# EAGLE design interstage_A2 (EAGLE 9.6.1)
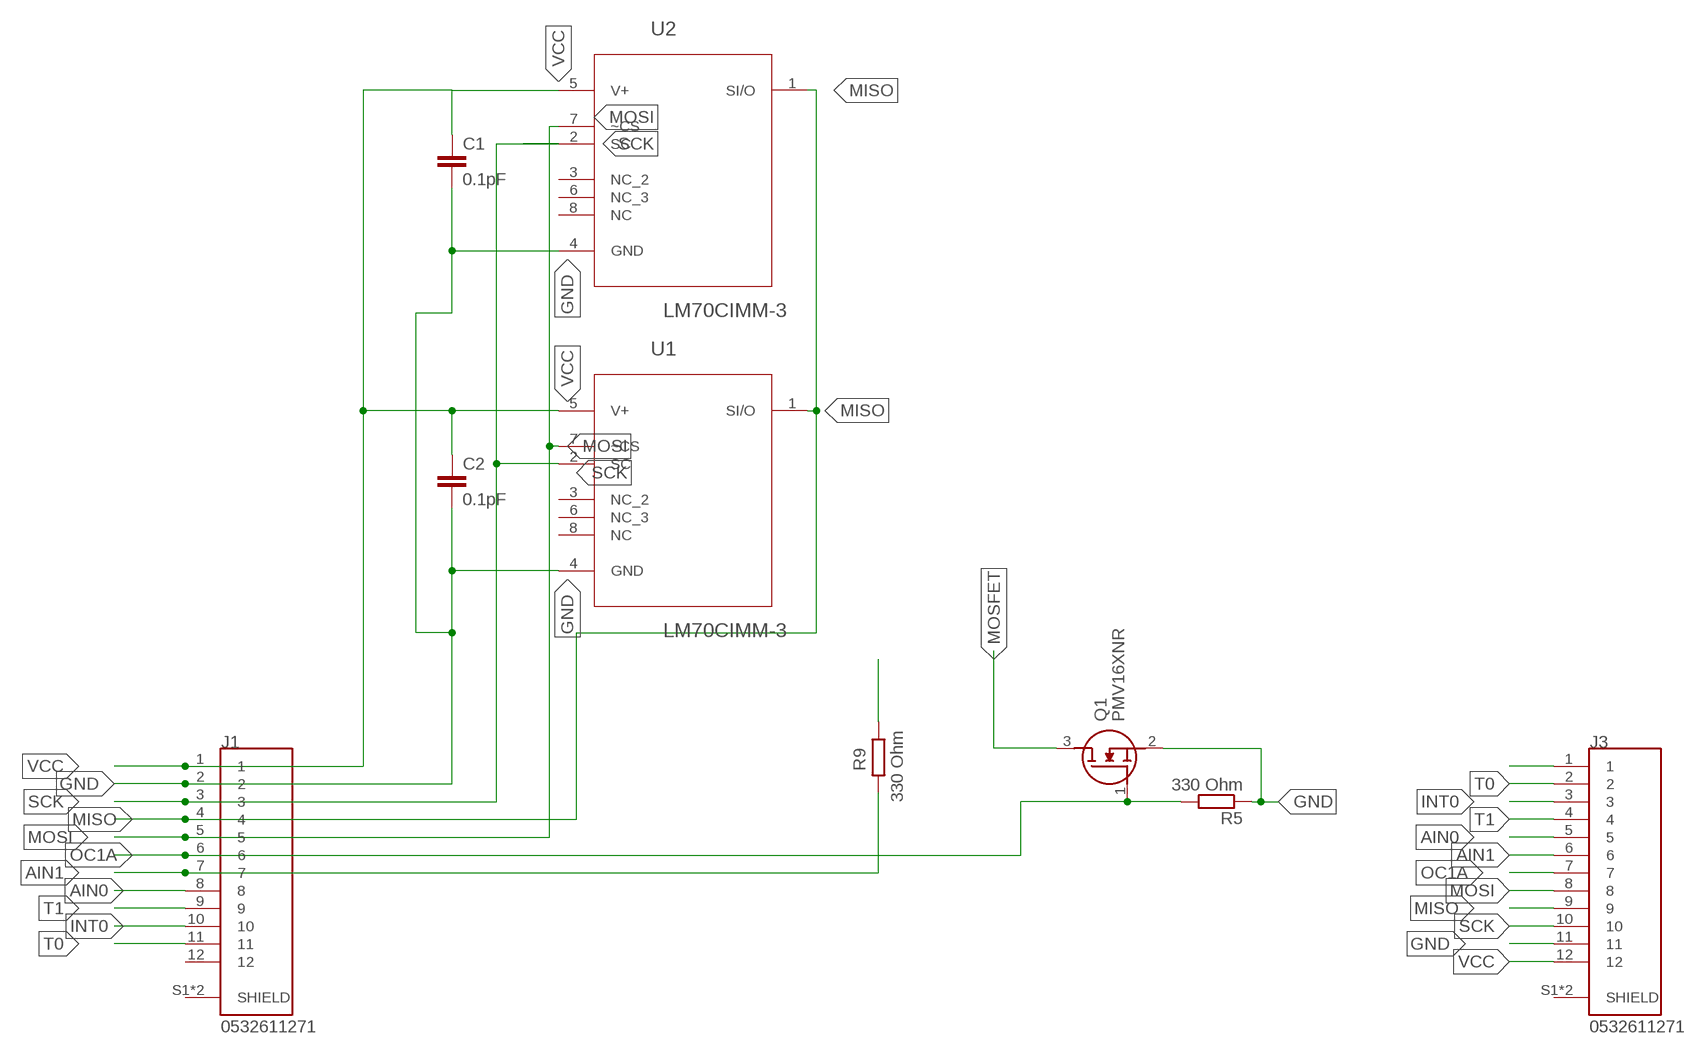
[diagram p0: schematic, sheet 1]

## Parts
C1  0.1pF  C-EUC0603K  [C0603K]
C2  0.1pF  C-EUC0603K  [C0603K]
J1  0532611271  [MOLEX_0532611271]
J3  0532611271  [MOLEX_0532611271]
Q1  PMV16XNR  [SOT95P230X110-3N]
R5  330 Ohm  R-EU_R1206  [R1206]
R9  330 Ohm  R-EU_R1206  [R1206]
U1  LM70CIMM-3  [SOP65P490X110-8N]
U2  LM70CIMM-3  [SOP65P490X110-8N]

## Nets
AIN0: J1.8 J3.5
AIN1: J1.7 J3.6 R9.2
GND: C1.2 C2.2 J1.2 J3.11 Q1.2(S) R5.1 U1.4(GND) U2.4(GND)
INT0: J1.10 J3.3
MISO: J1.4 J3.9 U1.1(SI/O) U2.1(SI/O)
MOSFET: Q1.3(D)
MOSI: J1.5 J3.8 U1.7(~CS) U2.7(~CS)
N$3: J3.1
N$4: R9.1
OC1A: J1.6 J3.7 Q1.1(G) R5.2
SCK: J1.3 J3.10 U1.2(SC) U2.2(SC)
T0: J1.11 J3.2
T1: J1.9 J3.4
VCC: C1.1 C2.1 J1.1 J3.12 U1.5(V+) U2.5(V+)
Unconnected: J1.12 J1.S1(SHIELD) J1.S2(SHIELD) J3.S1(SHIELD) J3.S2(SHIELD) U1.3(NC_2) U1.6(NC_3) U1.8(NC) U2.3(NC_2) U2.6(NC_3) U2.8(NC)

## Library data of the parts
C1 C2 = rcl:C-EU: CAPACITOR, European symbol; SPICEPREFIX: C
J1 J3 = picoblade:0532611271: Conn Shrouded Header HDR 12 POS 1.25mm Solder RA SMD PicoBlade; AVAILABILITY: Unavailable; DESCRIPTION: Picoblade Connector, 12 Circuit Single Row, Right Angle Surface Mount SMT PCB; MF: Molex; MP: 0532611271; PACKAGE: None; PRICE: None
Q1 = SamacSys_Parts:PMV16XNR: Nexperia PMV16XNR N-channel MOSFET, 8.6 A, 20 V PMV16XN, 3-Pin SOT-23 Source: Datasheet <https://componentsearchengine.com/Datasheets/1/PMV16XNR.pdf>; DESCRIPTION: Nexperia PMV16XNR N-channel MOSFET, 8.6 A, 20 V PMV16XN, 3-Pin SOT-23; HEIGHT: 1.1mm; MANUFACTURER_NAME: Nexperia; MANUFACTURER_PART_NUMBER: PMV16XNR; MOUSER_PART_NUMBER: 771-PMV16XNR; MOUSER_PRICE-STOCK: https://www.mouser.com/Search/Refine.aspx?Keyword=771-PMV16XNR
R5 R9 = rcl:R-EU_: RESISTOR, European symbol; SPICEPREFIX: R
U1 U2 = LM70CIMM-3:LM70CIMM-3: 10-Bit plus Sign Digital Temperature Sensor; AVAILABILITY: Unavailable; DESCRIPTION: Temperature Sensor Digital, Local -55°C ~ 150°C 10 b 8-VSSOP; MF: Texas Instruments; MP: LM70CIMM-3/NOPB; PACKAGE: MSOP-8 Texas Instruments; PRICE: None

## Board
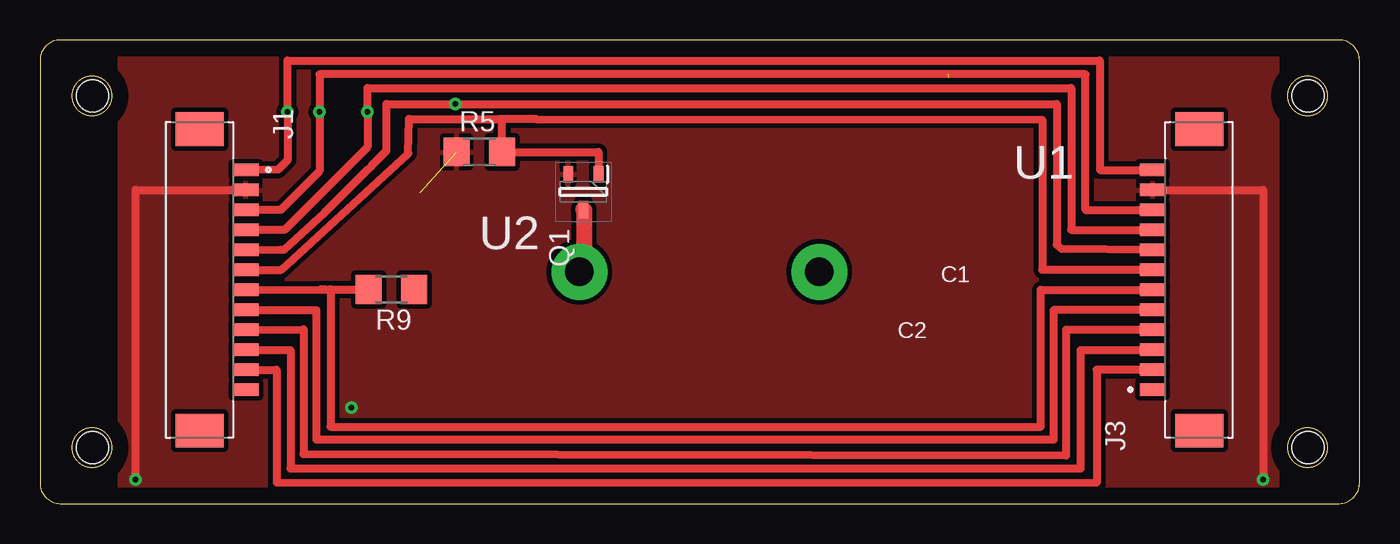
[diagram p1: board, top side]
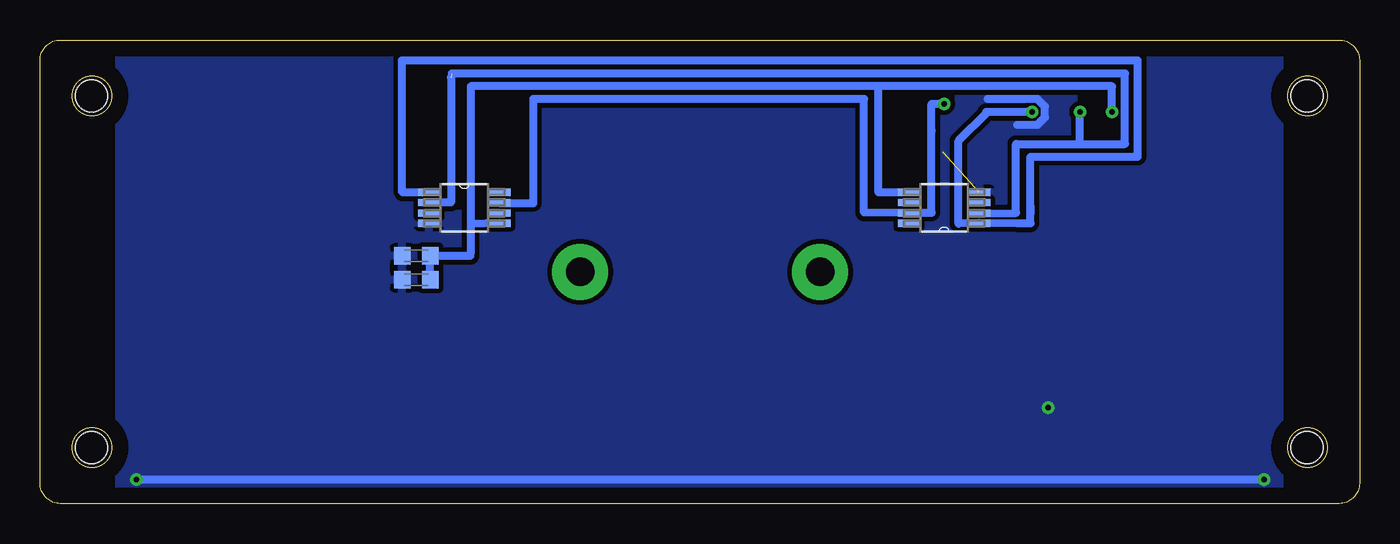
[diagram p2: board, bottom side, seen from below]

Size 82.5 x 29 mm. Coordinates in mm from the lower left corner, seen from the top.
Outline: 0,1.27 arc90 1.27,0 81.23,0 arc90 82.5,1.27 82.5,27.73 arc90 81.23,29 1.27,29 arc90 0,27.73 0,1.27
Outline: circle at 79.25,3.5 radius 1.25
Outline: circle at 3.25,25.5 radius 1.25
Outline: circle at 3.25,3.5 radius 1.25
Outline: circle at 79.25,25.5 radius 1.25
Copper layers (1*16): Top 0.035mm / dielectric 1.5mm / Bottom 0.035mm
Design rules "default *": minimum track width 6mil, minimum drill 0.35mm, track to track 0.3mm, track to pad 6mil, pad to pad 6mil, via to via 6mil, smd to smd 6mil, copper to edge 40mil, drill to drill 6mil, minimum pad ring 10mil, minimum via ring 8mil, stop-mask expansion 4mil, vias tented up to drill 0mil, thermal gap 10mil
Holes 2 mm at 3.27,3.5 3.27,25.5 79.27,25.5 79.27,3.5

### Footprints (pad centres in the part's own frame; a part is rotated, then mirrored left to right if it is on the bottom)
C0603K = smd 1.05 x 1.08: 1 -0.875,0; 2 0.875,0
MOLEX_0532611271 = smd 0.8 x 1.6: 1 -6.875,2.9; 2 -5.625,2.9; 3 -4.375,2.9; 4 -3.125,2.9; 5 -1.875,2.9; 6 -0.625,2.9; 7 0.625,2.9; 8 1.875,2.9; 9 3.125,2.9; 10 4.375,2.9; 11 5.625,2.9; 12 6.875,2.9 | smd 2.1 x 3: S1 -9.425,0; S2 9.425,0
SOT95P230X110-3N = smd 1.05 x 0.6: 1 -1.1,0.95; 2 -1.1,-0.95; 3 1.1,0
R1206 = smd 1.6 x 1.803: 1 -1.422,0; 2 1.422,0
SOP65P490X110-8N = smd 1.372 x 0.457: 1 -2.21,0.965; 2 -2.21,0.33; 3 -2.21,-0.33; 4 -2.21,-0.965; 5 2.21,-0.965; 6 2.21,-0.33; 7 2.21,0.33; 8 2.21,0.965

### Placement (x,y rotation side)
C1  58.97,15.5 180 bottom
C2  58.97,14 180 bottom
J1  9.97,14 270 top
J3  72.47,14 90 top
Q1  33.97,19.5 270 top
R5  27.47,22 0 top
R9  21.97,13.4 180 top
U1  55.97,18.5 0 bottom
U2  25.97,18.5 180 bottom

### Tracks (layer width: path | path; a pad name or v marks a point on that pad's centre or on a via)
AIN0
  Top 0.5: J1.8 17.27,12.1 17.27,4 63.37,4 63.37,12.1 J3.5
AIN1
  Top 0.5: J3.6 62.57,13.38 62.57,4.8 18.17,4.8 18.17,13.39 | J1.7 17.57,13.39 17.77,13.39 18.17,13.39 | 18.17,13.39 R9.2
GND  (via drill 0.35)  (1 unrouted)
  Top 0.5: 11.97,19.62 J1.2 5.97,19.62 v5.97,1.5 | J3.11 76.47,19.62 v76.47,1.5
  Bottom 0.5: v5.97,1.5 v76.47,1.5 | U2.4 | 23.25,25.3 20.14,25.3 19.67,24.83 19.67,24.17 20.14,23.7 21.4,23.7
  other vias: 19.47,6
  pour Top: 4.97,28 4.97,0.5 77.37,0.5 77.37,28
  pour Bottom: 4.97,28 77.57,28 77.57,0.5 4.97,0.5
INT0
  Top 0.5: J1.10 15.67,9.6 15.67,2.2 65.07,2.2 65.07,9.6 J3.3
MISO  (via drill 0.35)
  Top 0.5: J3.9 64.47,17.12 64.47,26 20.47,26 v20.47,24.5 | v20.47,24.5 20.47,24.9 | v20.47,24.5 20.47,22.3 15.29,17.12 J1.4
  Bottom 0.5: U1.1 59.81,19.46 59.87,19.52 59.87,27.7 13.87,27.7 13.87,21.7 20.57,21.7 20.57,18.17 | 20.57,18.55 20.57,18.17 | 20.57,18.17 20.57,17.52 21.37,17.52 23.86,17.53 U2.1 25.07,17.51 25.07,22.7 23.37,24.4 23.35,24.5 v20.47,24.5
MOSFET  (via drill 1.8 pad 3.5)
  Top 1: Q1.3 34.02,18.35 34.02,14.8 v33.72,14.5
MOSI  (via drill 0.35)
  Top 0.5: J3.8 63.87,15.92 63.57,16.18 63.57,25 v25.97,25 21.67,25 21.67,22.07 20.75,21.15 20.75,21.12 20.52,20.91 20.3,20.7 20.29,20.7 17.79,18.19 15.26,15.88 15.07,15.88 J1.5
  Bottom 0.5: v25.97,25 26.76,25 26.76,23.3 | 26.76,23.3 26.77,18.2 28.25,18.2 U2.7 30.97,18.21 30.97,25.3 51.67,25.3 51.67,18.79 53.72,18.79 U1.7 | 26.76,23.3
N$2  (via drill 1.8 pad 3.5)
  other vias: 48.72,14.5
OC1A
  Top 0.5: 28.72,24.05 23.06,24.05 23.02,21.89 15.07,14.62 J1.6 | J3.7 62.67,14.62 62.67,24 31.07,24.05 29.57,24.05 28.97,24.05 | Q1.1 34.92,22 R5.2 28.89,23.97 28.97,24.05 | 28.97,24.05 28.72,24.05 | 28.72,24.05
SCK  (via drill 0.35)  (1 unrouted)
  Top 0.5: J3.10 65.37,18.38 65.37,26.85 17.47,26.85 v17.47,24.5 17.47,20.8 15.17,18.49 15.06,18.38 J1.3
  Bottom 0.5: U2.2 23.84,18.15 21.47,18.17 21.47,22.5 17.47,22.5 | U1.2 56.81,18.83 56.81,26.65 | 17.47,22.5 v17.47,24.5 | 17.47,22.5 14.67,22.5 14.67,26.9 56.76,26.9
T0
  Top 0.5: J3.2 66.07,8.38 66.07,1.3 14.8,1.32 14.79,8.38 J1.11
T1
  Top 0.5: J3.4 64.17,10.88 64.17,3 16.47,3.1 16.47,10.9 J1.9
VCC  (via drill 0.35)
  Top 0.5: J3.12 66.27,20.88 66.25,27.7 15.47,27.7 v15.47,24.5 15.47,21.47 14.89,20.89 J1.1
  Bottom 0.5: 30.07,26.1 15.47,26.1 v15.47,24.5 | 55.57,17.5 55.57,26.1 30.07,26.1 | U1.5 55.57,17.5 | U2.5 30.07,19.46 30.07,26.1 | C2.1 C1.1 55.58,15.5 55.57,15.7 55.57,17.5